# EAGLE schematic oresat-card (EAGLE 9.3.0)

## Sheet 1 of 2: Connectors
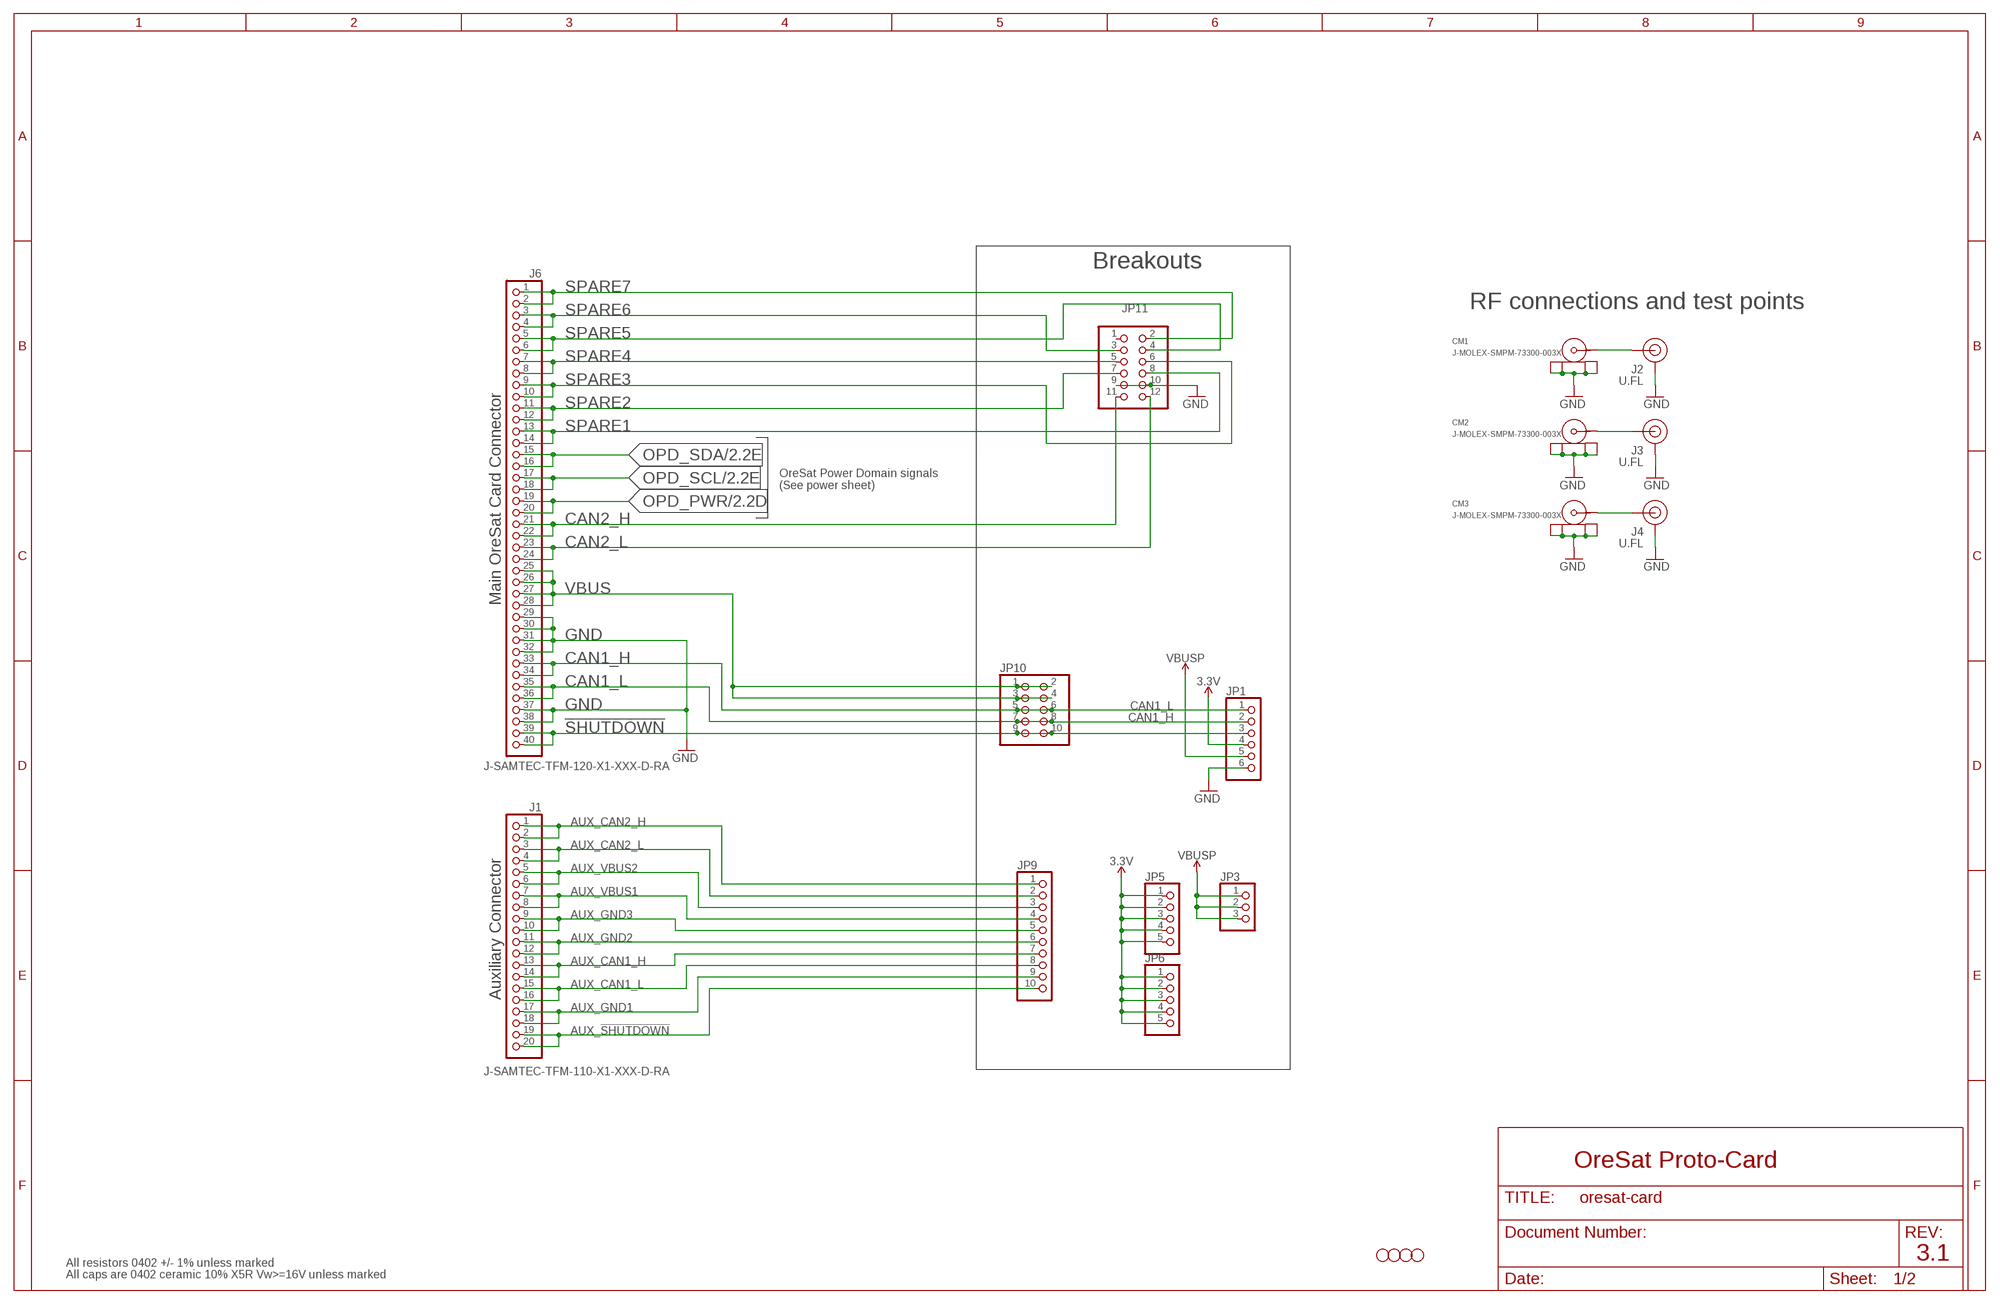
[diagram p0: schematic, sheet 1]

### Parts
CM1  J-MOLEX-SMPM-73300-003X  [J-MOLEX-SMPM-073300-003X]
CM2  J-MOLEX-SMPM-73300-003X  [J-MOLEX-SMPM-073300-003X]
CM3  J-MOLEX-SMPM-73300-003X  [J-MOLEX-SMPM-073300-003X]
H1  STAND-OFFTIGHT  [STAND-OFF-TIGHT]
H2  STAND-OFFTIGHT  [STAND-OFF-TIGHT]
H3  STAND-OFFTIGHT  [STAND-OFF-TIGHT]
H4  STAND-OFFTIGHT  [STAND-OFF-TIGHT]
J1  J-SAMTEC-TFM-110-X1-XXX-D-RA  [J-SAMTEC-TFM-110-X1-XXX-D-RA]
J2  U.FL  U.FL2PIN  [U.FL]
J3  U.FL  U.FL2PIN  [U.FL]
J4  U.FL  U.FL2PIN  [U.FL]
J6  J-SAMTEC-TFM-120-X1-XXX-D-RA  [J-SAMTEC-TFM-120-X1-XXX-D-RA]
JP1  PINHD-1X6  [1X06]
JP3  PINHD-1X3  [1X03]
JP5  PINHD-1X5  [1X05]
JP6  PINHD-1X5  [1X05]
JP9  PINHD-1X10  [1X10]
JP10  PINHD-2X5  [2X05]
JP11  PINHD-2X6  [2X06]

### Nets
3.3V: JP1.4 JP5.1 JP5.2 JP5.3 JP5.4 JP5.5 JP6.1 JP6.2 JP6.3 JP6.4 JP6.5 ; also sheet 2
!SHUTDOWN: J6.39 J6.40 JP1.3 JP10.9 JP10.10
AUX_!SHUTDOWN: J1.19 J1.20 JP9.10
AUX_CAN1_H: J1.13 J1.14 JP9.7
AUX_CAN1_L: J1.15 J1.16 JP9.8
AUX_CAN2_H: J1.1 J1.2 JP9.1
AUX_CAN2_L: J1.3 J1.4 JP9.2
AUX_GND1: J1.17 J1.18 JP9.9
AUX_GND2: J1.11 J1.12 JP9.6
AUX_GND3: J1.9 J1.10 JP9.5
AUX_VBUS1: J1.7 J1.8 JP9.4
AUX_VBUS2: J1.5 J1.6 JP9.3
CAN1_H: J6.33 J6.34 JP1.1 JP10.5 JP10.6
CAN1_L: J6.35 J6.36 JP1.2 JP10.7 JP10.8
CAN2_H: J6.21 J6.22 JP11.11
CAN2_L: J6.23 J6.24 JP11.12
GND: CM1.P$1(SHIELD3) CM1.P$2(SHIELD2) CM1.P$3(SHIELD1) CM1.P$4(SHIELD) CM2.P$1(SHIELD3) CM2.P$2(SHIELD2) CM2.P$3(SHIELD1) CM2.P$4(SHIELD) CM3.P$1(SHIELD3) CM3.P$2(SHIELD2) CM3.P$3(SHIELD1) CM3.P$4(SHIELD) J2.1(GND) J2.2(GND) J3.1(GND) J3.2(GND) J4.1(GND) J4.2(GND) J6.29 J6.30 J6.31 J6.32 J6.37 J6.38 JP1.6 JP11.9 JP11.10 ; also sheet 2
N$300: CM3.RF(CENTER) J4.FEED(SIGNAL)
OPD_PWR: J6.19 J6.20 ; also sheet 2
OPD_SCL: J6.17 J6.18 ; also sheet 2
OPD_SDA: J6.15 J6.16 ; also sheet 2
RF1: CM1.RF(CENTER) J2.FEED(SIGNAL)
RF2: CM2.RF(CENTER) J3.FEED(SIGNAL)
SPARE1: J6.13 J6.14 JP11.8
SPARE2: J6.11 J6.12 JP11.7
SPARE3: J6.9 J6.10 JP11.6
SPARE4: J6.7 J6.8 JP11.5
SPARE5: J6.5 J6.6 JP11.4
SPARE6: J6.3 J6.4 JP11.3
SPARE7: J6.1 J6.2 JP11.2
VBUS: J6.25 J6.26 J6.27 J6.28 JP10.1 JP10.2 JP10.3 JP10.4 ; also sheet 2
VBUSP: JP1.5 JP3.1 JP3.2 JP3.3 ; also sheet 2
Unconnected: JP11.1

### Notes on the sheet
- Breakouts
- RF connections and test points
- OreSat Power Domain signals
  (See power sheet)
- Main OreSat Card Connector
- Auxiliary Connector
- OreSat Proto-Card
- 3.1
- All resistors 0402 +/- 1% unless marked
- All caps are 0402 ceramic 10% X5R Vw>=16V unless marked

## Sheet 2 of 2: Power
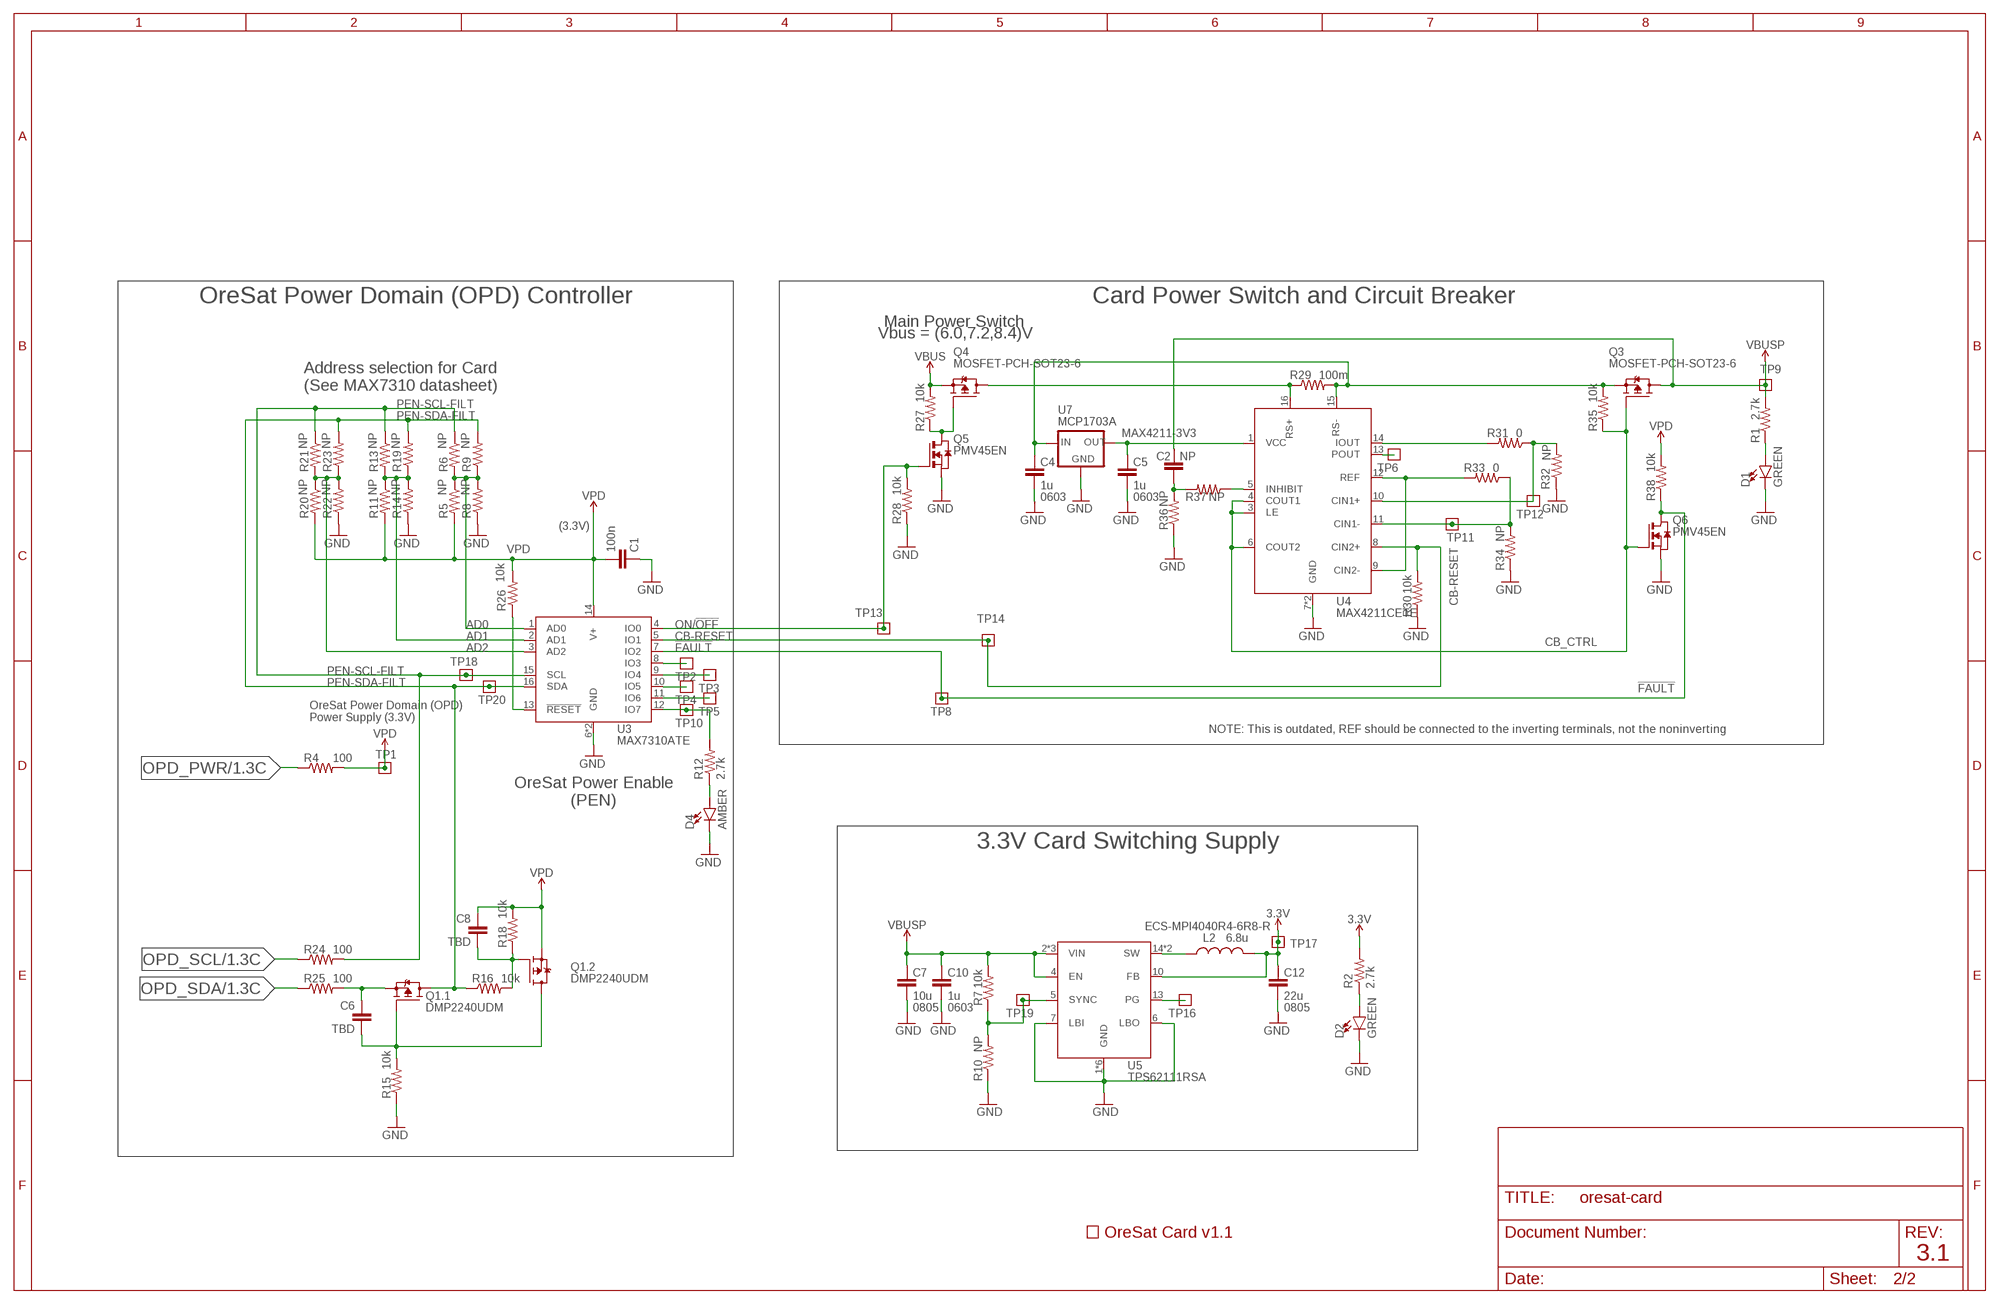
[diagram p1: schematic, sheet 2]

### Parts
C1  100n  C-EU0402-B-NOSILK  [.0402-B-NOSILK]
C2  NP  C-EU0402-B-NOSILK  [.0402-B-NOSILK]
C4  1u  C-EU0603-B-NOSILK  [.0603-B-NOSILK]
C5  1u  C-EU0603-B-NOSILK  [.0603-B-NOSILK]
C6  TBD  C-EU0402-B-NOSILK  [.0402-B-NOSILK]
C7  10u  C-EU0805-B-NOSILK  [.0805-B-NOSILK]
C8  TBD  C-EU0402-B-NOSILK  [.0402-B-NOSILK]
C10  1u  C-EU0603-B-NOSILK  [.0603-B-NOSILK]
C12  22u  C-EU0805-B-NOSILK  [.0805-B-NOSILK]
D1  GREEN  LED-GREEN0603  [LED-0603]
D2  GREEN  LED-GREEN0603  [LED-0603]
D4  AMBER  LED-GREEN0603  [LED-0603]
L2  6.8u  L-ECS-MPI4040  [ECS-MPI4040]
Q1  DMP2240UDM  MOSFET-PCH-SOT23-6  [SOT23-6]
Q3  MOSFET-PCH-SOT23-6  [SOT23-6]
Q4  MOSFET-PCH-SOT23-6  [SOT23-6]
Q5  PMV45EN  [SOT23]
Q6  PMV45EN  [SOT23]
R1  2.7k  R-US_0402-B-NOSILK  [.0402-B-NOSILK]
R2  2.7k  R-US_0402-B-NOSILK  [.0402-B-NOSILK]
R4  100  R-US_0402-B-NOSILK  [.0402-B-NOSILK]
R5  NP  R-US_0402-B-NOSILK  [.0402-B-NOSILK]
R6  NP  R-US_0402-B-NOSILK  [.0402-B-NOSILK]
R7  10k  R-US_0402-B-NOSILK  [.0402-B-NOSILK]
R8  NP  R-US_0402-B-NOSILK  [.0402-B-NOSILK]
R9  NP  R-US_0402-B-NOSILK  [.0402-B-NOSILK]
R10  NP  R-US_0402-B-NOSILK  [.0402-B-NOSILK]
R11  NP  R-US_0402-B-NOSILK  [.0402-B-NOSILK]
R12  2.7k  R-US_0402-B-NOSILK  [.0402-B-NOSILK]
R13  NP  R-US_0402-B-NOSILK  [.0402-B-NOSILK]
R14  NP  R-US_0402-B-NOSILK  [.0402-B-NOSILK]
R15  10k  R-US_0402-B-NOSILK  [.0402-B-NOSILK]
R16  10k  R-US_0402-B-NOSILK  [.0402-B-NOSILK]
R18  10k  R-US_0402-B-NOSILK  [.0402-B-NOSILK]
R19  NP  R-US_0402-B-NOSILK  [.0402-B-NOSILK]
R20  NP  R-US_0402-B-NOSILK  [.0402-B-NOSILK]
R21  NP  R-US_0402-B-NOSILK  [.0402-B-NOSILK]
R22  NP  R-US_0402-B-NOSILK  [.0402-B-NOSILK]
R23  NP  R-US_0402-B-NOSILK  [.0402-B-NOSILK]
R24  100  R-US_0402-B-NOSILK  [.0402-B-NOSILK]
R25  100  R-US_0402-B-NOSILK  [.0402-B-NOSILK]
R26  10k  R-US_0402-B-NOSILK  [.0402-B-NOSILK]
R27  10k  R-US_0402-B-NOSILK  [.0402-B-NOSILK]
R28  10k  R-US_0402-B-NOSILK  [.0402-B-NOSILK]
R29  100m  R-US_R1206  [R1206]
R30  10k  R-US_0402-B-NOSILK  [.0402-B-NOSILK]
R31  0  R-US_0402-B-NOSILK  [.0402-B-NOSILK]
R32  NP  R-US_0402-B-NOSILK  [.0402-B-NOSILK]
R33  0  R-US_0402-B-NOSILK  [.0402-B-NOSILK]
R34  NP  R-US_0402-B-NOSILK  [.0402-B-NOSILK]
R35  10k  R-US_0402-B-NOSILK  [.0402-B-NOSILK]
R36  NP  R-US_0402-B-NOSILK  [.0402-B-NOSILK]
R37  NP  R-US_0402-B-NOSILK  [.0402-B-NOSILK]
R38  10k  R-US_0402-B-NOSILK  [.0402-B-NOSILK]
TP1  TEST-POINT  [2MM-TEST-POINT]
TP2  TEST-POINT  [2MM-TEST-POINT]
TP3  TEST-POINT  [2MM-TEST-POINT]
TP4  TEST-POINT  [2MM-TEST-POINT]
TP5  TEST-POINT  [2MM-TEST-POINT]
TP6  TEST-POINT  [2MM-TEST-POINT]
TP8  TEST-POINT  [2MM-TEST-POINT]
TP9  TEST-POINT  [2MM-TEST-POINT]
TP10  TEST-POINT  [2MM-TEST-POINT]
TP11  TEST-POINT  [2MM-TEST-POINT]
TP12  TEST-POINT  [2MM-TEST-POINT]
TP13  TEST-POINT  [2MM-TEST-POINT]
TP14  TEST-POINT  [2MM-TEST-POINT]
TP16  TEST-POINT  [2MM-TEST-POINT]
TP17  TEST-POINT  [2MM-TEST-POINT]
TP18  TEST-POINT  [2MM-TEST-POINT]
TP19  TEST-POINT  [2MM-TEST-POINT]
TP20  TEST-POINT  [2MM-TEST-POINT]
U3  MAX7310ATE  MAX7310  [QFN65P400X400X80-17T210]
U4  MAX4211CETE  MAX4211  [QFN65P400X400X80-17T210]
U5  TPS62111RSA  TPS6211X  [S-PVQFN-16]
U7  MCP1703A  XC63FPM  [SOT23]
U$1  ORESAT-CARD-V1.1-3XRF  [ORESAT-CARD-V1.1-3XRF]

### Nets
3.3V: C12.1 L2.2 R2.2 TP17.1 U5.10(FB) ; also sheet 1
!FAULT: Q6.3(D) R38.1 TP8.1 U3.7(IO2)
AD0: R5.1 R6.2 R8.2 R9.1 U3.1(AD0)
AD1: R11.1 R13.2 R14.2 R19.1 U3.2(AD1)
AD2: R20.1 R21.2 R22.2 R23.1 U3.3(AD2)
CB-RESET: R30.2 TP14.1 U3.5(IO1) U4.8(CIN2+)
CB_CTRL: Q3.3(G) Q6.1(G) R35.1 U4.3(LE) U4.4(COUT1) U4.6(COUT2)
GND: C1.1 C4.2 C5.2 C7.2 C10.2 C12.2 D1.C D2.C D4.C Q5.2(S) Q6.2(S) R8.1 R10.1 R14.1 R15.1 R22.1 R28.1 R30.1 R32.1 R34.1 R36.1 U3.6(GND) U3.EPAD(GND) U4.7(GND) U4.EPAD(GND) U5.1(GND) U5.6(LBO) U5.7(LBI) U5.9(GND) U5.11(GND) U5.12(GND) U5.16(GND) U5.PAD(GND) U7.1(GND) ; also sheet 1
MAX4211-3V3: C5.1 U4.1(VCC) U7.2(OUT)
N$270: D1.A R1.1
N$271: D2.A R2.1
N$398: C4.1 Q3.4(S) R29.2 R35.2 U4.15(RS-) U7.3(IN)
N$480: TP2.1 U3.8(IO3)
N$482: TP3.1 U3.9(IO4)
N$518: TP4.1 U3.10(IO5)
N$523: TP5.1 U3.11(IO6)
N$573: R12.2 TP10.1 U3.12(IO7)
N$575: D4.A R12.1
N$579: C6.1 Q1.5(.1:S) R25.2
N$580: C6.2 Q1.1(.1:G) Q1.4(.2:D) R15.2
N$581: C8.2 Q1.3(.2:G) R16.2 R18.1
N$589: R26.1 U3.13(!RESET)
N$590: Q4.3(G) Q5.3(D) R27.1
N$593: Q4.1(D) Q4.2(D) Q4.5(D) Q4.6(D) R29.1 U4.16(RS+)
N$596: R31.1 R32.2 TP12.1 U4.10(CIN1+)
N$597: R33.1 R34.2 TP11.1 U4.11(CIN1-)
N$598: R31.2 U4.14(IOUT)
N$599: R33.2 U4.9(CIN2-) U4.12(REF)
N$600: TP6.1 U4.13(POUT)
N$603: C2.1 R36.2 R37.2
N$604: R37.1 U4.5(INHIBIT)
ON/!OFF: Q5.1(G) R28.2 TP13.1 U3.4(IO0)
OPD_PWR: R4.1 ; also sheet 1
OPD_SCL: R24.1 ; also sheet 1
OPD_SDA: R25.1 ; also sheet 1
PEN-SCL-FILT: R6.1 R13.1 R21.1 R24.2 TP18.1 U3.15(SCL)
PEN-SDA-FILT: Q1.6(.1:D) R9.2 R16.1 R19.2 R23.2 TP20.1 U3.16(SDA)
TPS62111-PG: TP16.1 U5.13(PG)
TPS62111-SYNC: R7.1 R10.2 TP19.1 U5.5(SYNC)
TPS62111_SW: L2.1 U5.14(SW) U5.15(SW)
VBUS: Q4.4(S) R27.2 ; also sheet 1
VBUSP: C2.2 C7.1 C10.1 Q3.1(D) Q3.2(D) Q3.5(D) Q3.6(D) R1.2 R7.2 TP9.1 U5.2(VIN) U5.3(VIN) U5.4(EN) U5.8(VIN) ; also sheet 1
VPD: C1.2 C8.1 Q1.2(.2:S) R4.2 R5.2 R11.2 R18.2 R20.2 R26.2 R38.2 TP1.1 U3.14(V+)

### Notes on the sheet
- OreSat Power Domain (OPD) Controller | Card Power Switch and Circuit Breaker
- Main Power Switch
- Vbus = (6.0,7.2,8.4)V
- Address selection for Card
  (See MAX7310 datasheet)
- 0603 | 0603
- (3.3V)
- OreSat Power Domain (OPD)
  Power Supply (3.3V)
- NOTE: This is outdated, REF should be connected to the inverting terminals, not the noninverting
- OreSat Power Enable
  (PEN)
- 3.3V Card Switching Supply
- ECS-MPI4040R4-6R8-R
- 0805 | 0603 | 0805
- 3.1

## Library data of the parts
C1 C2 C6 C8 = rcl_custom:C-EU: CAPACITOR, European symbol; DIS: Digi-Key; DPN: 1276-1001-1-ND; MFR: Samsung; MPN: CL05B104KO5NNNC
C4 C5 C10 = oresat-rcl:C-EU: CAPACITOR, European symbol; DIS: Digi-Key; DPN: 1276-1001-1-ND; MFR: Samsung; MPN: CL05B104KO5NNNC
C7 C12 = oresat-rcl:C-EU: CAPACITOR, European symbol
CM1-CM3 = J-Molex-SMPM-73300-003X:J-MOLEX-SMPM-73300-003X; MFR: Molex; MPN: 73300-0020
D1 D2 = SparkFun-LED:LED-GREEN: Green SMD LED Used in manufacturing of various products at SparkFun Packages: 0603 - SMD 0603 package [Product Link] <http://www.futureelectronics.com/en/technologies/semiconductors/optoelectronics/leds/Pages/9894312-LTST-C190GKT.aspx?CrossPart=HSMG-C190&IM=0> LilyPad 1206 - SMD1206 LilyPad package [Product Link] <http://www.futureelectronics.com/en/Technologies/Product.aspx?ProductID=IN150NGHARVATEKCORPORATION2049943&IM=0> 1206 - SMD1206 package [Product Link] <http://www.futureelectronics.com/en/technologies/semiconductors/optoelectronics/leds/Pages/8315665-LTST-C150KGKT.aspx?IM=0> 1206 Bottom Mount -SMD 1206 Bottom Mount [Product Link] <http://www.digikey.com/product-detail/en/lite-on-inc/LTST-C230KGKT/160-1456-1-ND/386854> SparkFun Products: Pro Mini 328 -5V <https://www.sparkfun.com/products/821> RedBoard <https://www.sparkfun.com/products/12757> MP3 Trigger <https://www.sparkfun.com/products/13720> Makey Makey <https://www.sparkfun.com/products/11076>
D4 = SparkFun-LED:LED-GREEN: Green SMD LED Used in manufacturing of various products at SparkFun Packages: 0603 - SMD 0603 package [Product Link] <http://www.futureelectronics.com/en/technologies/semiconductors/optoelectronics/leds/Pages/9894312-LTST-C190GKT.aspx?CrossPart=HSMG-C190&IM=0> LilyPad 1206 - SMD1206 LilyPad package [Product Link] <http://www.futureelectronics.com/en/Technologies/Product.aspx?ProductID=IN150NGHARVATEKCORPORATION2049943&IM=0> 1206 - SMD1206 package [Product Link] <http://www.futureelectronics.com/en/technologies/semiconductors/optoelectronics/leds/Pages/8315665-LTST-C150KGKT.aspx?IM=0> 1206 Bottom Mount -SMD 1206 Bottom Mount [Product Link] <http://www.digikey.com/product-detail/en/lite-on-inc/LTST-C230KGKT/160-1456-1-ND/386854> SparkFun Products: Pro Mini 328 -5V <https://www.sparkfun.com/products/821> RedBoard <https://www.sparkfun.com/products/12757> MP3 Trigger <https://www.sparkfun.com/products/13720> Makey Makey <https://www.sparkfun.com/products/11076>; VALUE: GREEN
H1-H4 = SparkFun-Hardware:STAND-OFF: Stand Off Drill holes for mechanically mounting via screws, standoffs, etc. Note: Use the keepout ring to avoid running the screw head into surrounding components. Variant Overviews STAND-OFF - Mechanical footprint for a #4 phillips button head screw. STAND-OFF-TIGHT - Mechanical footprint for a #4 phillips button head screw, Example SparkFun Products Screw - Phillips Head (1/4", 4-40, 10 pack) <https://www.sparkfun.com/products/10453> (PRT-10453) Screw - Phillips Head (1/2", 4-40, 10 pack) <https://www.sparkfun.com/products/10452> (PRT-10452) Screw - Phillips Head (3/4", 4-40, 10 pack) <https://www.sparkfun.com/products/10451> (PRT-10451) Screw - Phillips Head (1", 4-40, 10 pack) <https://www.sparkfun.com/products/10450> (PRT-10450)
J1 = J-Samtec-TFM-110-X1-XXX-D-RA:J-SAMTEC-TFM-110-X1-XXX-D-RA; MFR: Samtec; MPN: TFM-110-01-L-D-RA
J2-J4 = SparkFun-Connectors:U.FL2PIN: SMD Antenna Connector - U.FL 2mm height, 3.0mm x 3.0mm receptacle size. SparkFun Products: SparkFun WiFi Shield - ESP8266 <https://www.sparkfun.com/products/13287> SparkFun ESP8266 Thing <https://www.sparkfun.com/products/13231> SparkFun MiniGen - Pro Mini Signal Generator Shield <https://www.sparkfun.com/products/11420>; PROD_ID: CONN-09193; SF_ID: WRL-09144
J6 = J-Samtec-TFM-120-X1-XXX-D-RA:J-SAMTEC-TFM-120-X1-XXX-D-RA; MFR: Samtec; MPN: TFM-120-01-L-D-RA
JP1 = pinhead:PINHD-1X6: PIN HEADER
JP3 = pinhead:PINHD-1X3: PIN HEADER
JP5 JP6 = pinhead:PINHD-1X5: PIN HEADER
JP9 = pinhead:PINHD-1X10: PIN HEADER
JP10 = pinhead:PINHD-2X5: PIN HEADER
JP11 = pinhead:PINHD-2X6: PIN HEADER
L2 = L-ECS-MPI4040:L-ECS-MPI4040; MFR: ECS; MPN: ECS-MPI4040R4-6R8-R
Q1 = Q-MOSFET-PCH-dual-SOT23-6:MOSFET-PCH-SOT23-6: Dual P channel MOSFETs in an SOT23-6; MFR: Diodes Inc; MPN: DMP2240UDM
Q3 Q4 = Q-MOSFET-PCH-SOT23-6:MOSFET-PCH-SOT23-6: P channel MOSFET in an SOT23-6; MFR: Diodes Inc; MPN: DMP3050LVT-7
Q5 Q6 = Tova:PMV45EN
R1 R2 R4-R16 R18-R28 R30-R38 = rcl_custom:R-US_: RESISTOR, American symbol; DIS: Digi-Key; DPN: 1276-4275-1-ND; MFR: Samsung; MPN: RC1005F6653CS
R29 = rcl:R-US_: RESISTOR, American symbol; SPICEPREFIX: R
TP1-TP6 TP8-TP14 TP16-TP20 = Tova:TEST-POINT
U3 = U-Maxim-MAX7310-I2C-GPIO-expander:MAX7310; MFR: Maxim; MPN: MAX7310ATE
U4 = U-Maxim-MAX4211-power-monitor:MAX4211; MFR: Maxim; MPN: MAX4211CETE
U5 = U-TI-TPS6211x-SPS-buck:TPS6211X: TPS6211x 17-V, 1.5-A, Synchronous Step-Down Converter; MFR: TI; MPN: TPS62111RSA
U7 = v-reg:XC63FP: Positiv Voltage Regulators www.torex.co.jp/english/product/pro02/pdf/0201_xc62fp.pdf; MFR: Microchip; MPN: MCP1703AT-3302E/CB
U$1 = oresat-cards:ORESAT-CARD-V1.1